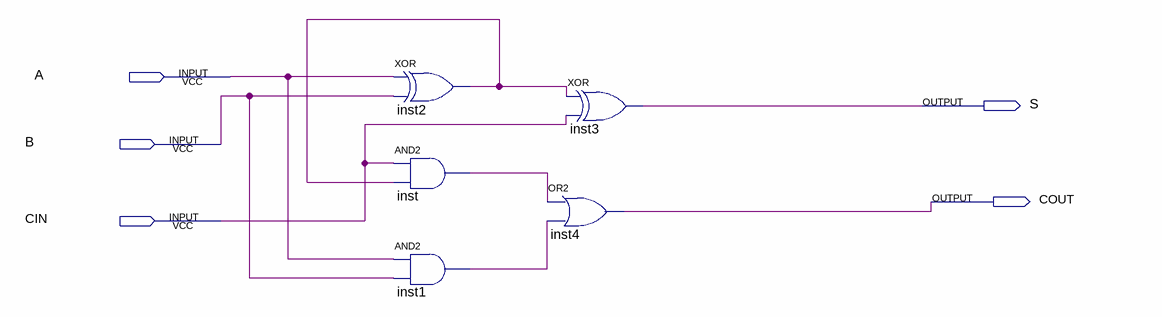
[diagram p0: schematic sheet]
// Quartus schematic alu.bdf as structural Verilog: 5 symbols, 5 pins
module alu (
  input  A,
  input  B,
  input  CIN,
  output S,
  output COUT
);

  wire inst1_out, inst2_out, inst_out;

  xor inst2 (inst2_out, A, B);
  and inst (inst_out, CIN, inst2_out);
  and inst1 (inst1_out, A, B);
  xor inst3 (S, inst2_out, CIN);
  or inst4 (COUT, inst_out, inst1_out);
endmodule
